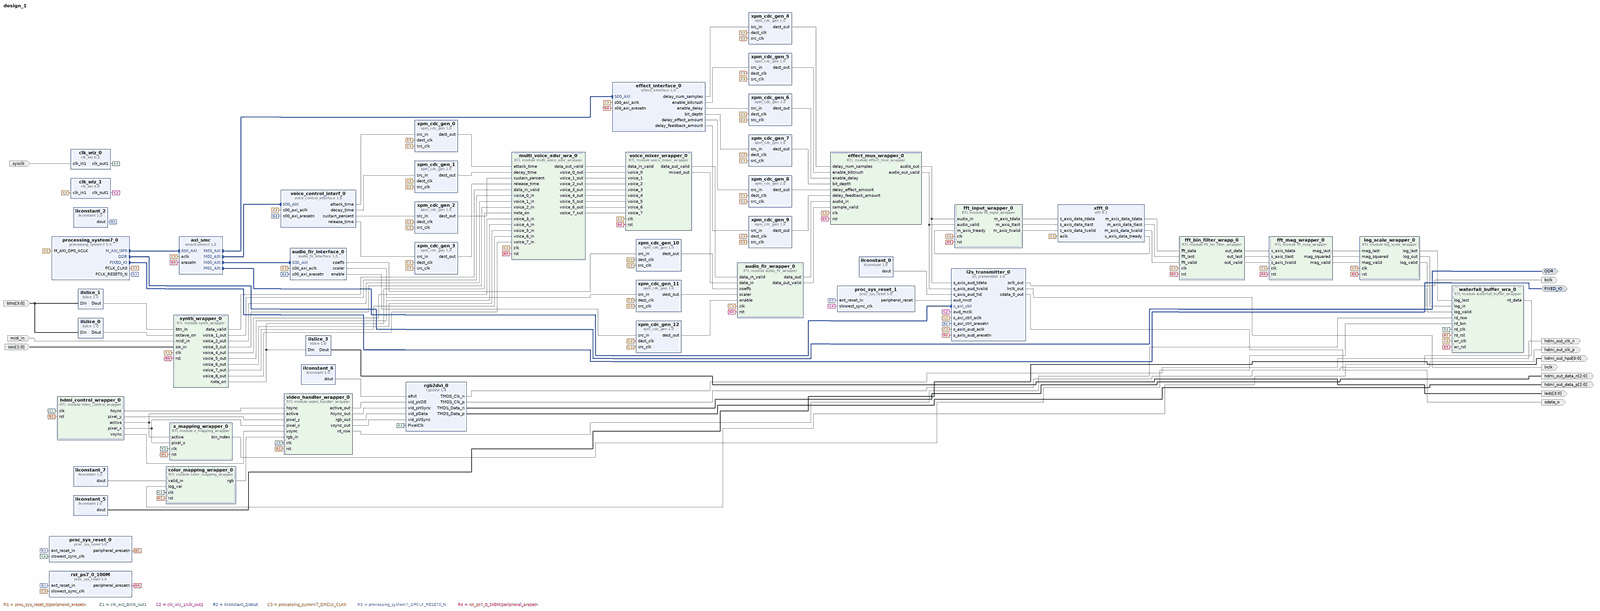
[diagram p0: block diagram of the top level, whole]
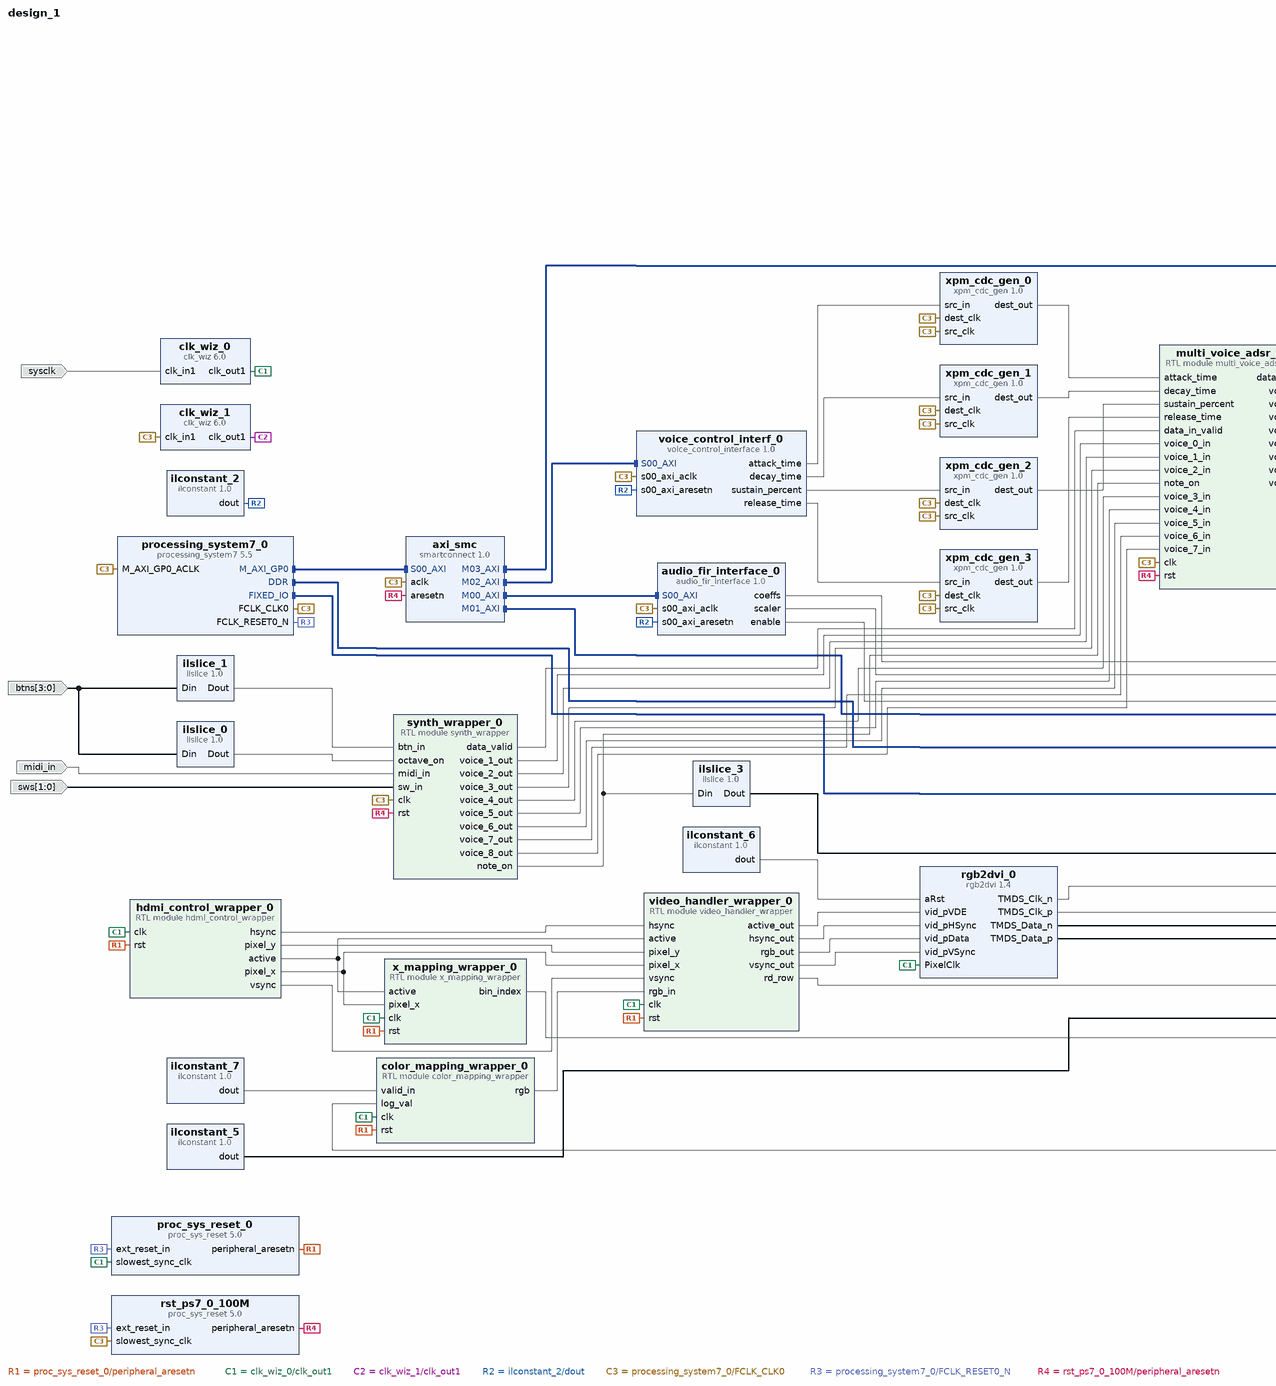
[diagram p1: block diagram of the top level, left part]
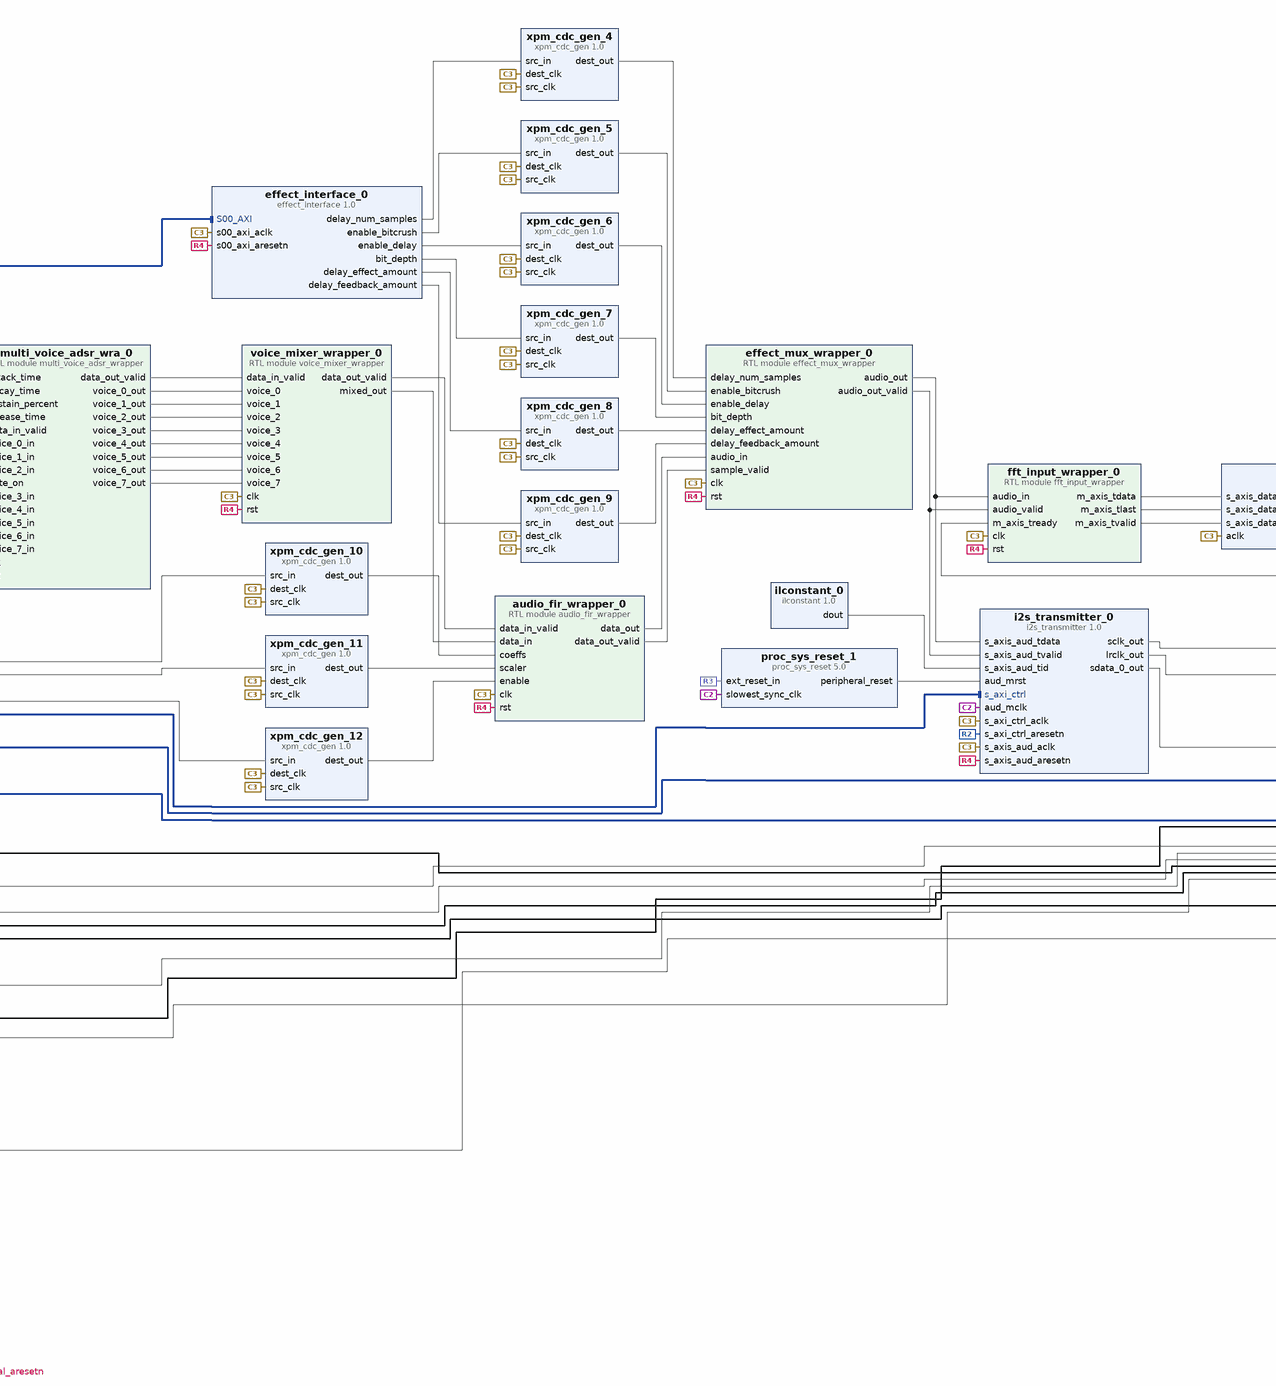
[diagram p2: block diagram of the top level, centre part]
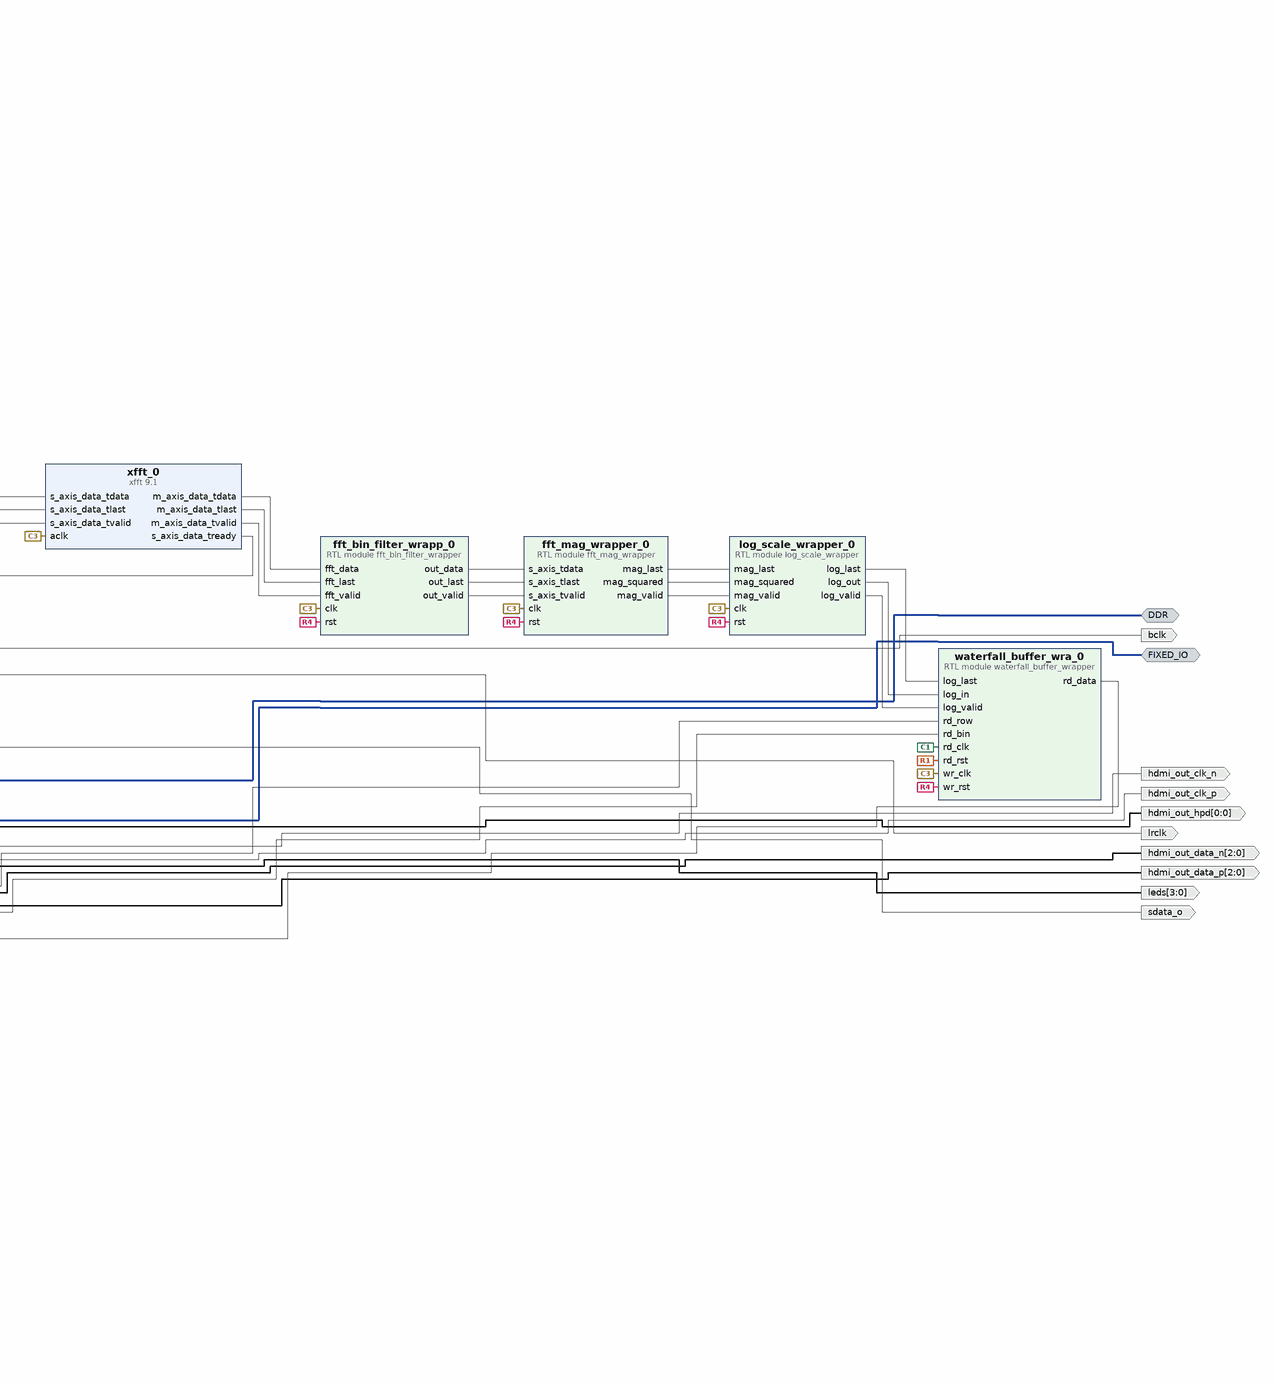
[diagram p3: block diagram of the top level, right part]
# Vivado block design design_1, xc7z020clg400-1, Vivado 2025.1
create_bd_design design_1

create_bd_intf_port -mode Master -vlnv xilinx.com:interface:ddrx_rtl:1.0 DDR
create_bd_intf_port -mode Master -vlnv xilinx.com:display_processing_system7:fixedio_rtl:1.0 FIXED_IO
create_bd_port -dir I -from 3 -to 0 btns
create_bd_port -dir I midi_in
create_bd_port -dir O lrclk
create_bd_port -dir O sdata_o
create_bd_port -dir O -from 3 -to 0 leds
create_bd_port -dir O hdmi_out_clk_p
create_bd_port -dir O hdmi_out_clk_n
create_bd_port -dir O -from 2 -to 0 hdmi_out_data_p
create_bd_port -dir O -from 2 -to 0 hdmi_out_data_n
create_bd_port -dir I sysclk
create_bd_port -dir O bclk
create_bd_port -dir O -from 0 -to 0 hdmi_out_hpd
create_bd_port -dir I -from 1 -to 0 sws

create_bd_cell -type ip -vlnv xilinx.com:ip:processing_system7:5.5 processing_system7_0
set_property -dict [list \
  CONFIG.PCW_APU_PERIPHERAL_FREQMHZ 650 \
  CONFIG.PCW_CRYSTAL_PERIPHERAL_FREQMHZ 50 \
  CONFIG.PCW_ENET0_ENET0_IO {MIO 16 .. 27} \
  CONFIG.PCW_ENET0_GRP_MDIO_ENABLE 1 \
  CONFIG.PCW_ENET0_GRP_MDIO_IO {MIO 52 .. 53} \
  CONFIG.PCW_ENET0_PERIPHERAL_ENABLE 1 \
  CONFIG.PCW_ENET0_RESET_ENABLE 1 \
  CONFIG.PCW_ENET0_RESET_IO {MIO 9} \
  CONFIG.PCW_ENET_RESET_ENABLE 1 \
  CONFIG.PCW_ENET_RESET_SELECT {Share reset pin} \
  CONFIG.PCW_FPGA0_PERIPHERAL_FREQMHZ 100 \
  CONFIG.PCW_FPGA1_PERIPHERAL_FREQMHZ 50 \
  CONFIG.PCW_GPIO_MIO_GPIO_ENABLE 1 \
  CONFIG.PCW_GPIO_MIO_GPIO_IO MIO \
  CONFIG.PCW_I2C_RESET_ENABLE 0 \
  CONFIG.PCW_M_AXI_GP0_FREQMHZ 10 \
  CONFIG.PCW_PERIPHERAL_BOARD_PRESET part0 \
  CONFIG.PCW_PRESET_BANK1_VOLTAGE {LVCMOS 1.8V} \
  CONFIG.PCW_QSPI_GRP_FBCLK_ENABLE 1 \
  CONFIG.PCW_QSPI_GRP_FBCLK_IO {MIO 8} \
  CONFIG.PCW_QSPI_GRP_SINGLE_SS_ENABLE 1 \
  CONFIG.PCW_QSPI_GRP_SINGLE_SS_IO {MIO 1 .. 6} \
  CONFIG.PCW_QSPI_PERIPHERAL_ENABLE 1 \
  CONFIG.PCW_QSPI_QSPI_IO {MIO 1 .. 6} \
  CONFIG.PCW_SD0_GRP_CD_ENABLE 1 \
  CONFIG.PCW_SD0_GRP_CD_IO {MIO 47} \
  CONFIG.PCW_SD0_GRP_WP_ENABLE 0 \
  CONFIG.PCW_SD0_PERIPHERAL_ENABLE 1 \
  CONFIG.PCW_SD0_SD0_IO {MIO 40 .. 45} \
  CONFIG.PCW_SDIO_PERIPHERAL_FREQMHZ 50 \
  CONFIG.PCW_SINGLE_QSPI_DATA_MODE x4 \
  CONFIG.PCW_UART0_PERIPHERAL_ENABLE 1 \
  CONFIG.PCW_UART0_UART0_IO {MIO 14 .. 15} \
  CONFIG.PCW_UART1_PERIPHERAL_ENABLE 0 \
  CONFIG.PCW_UART_PERIPHERAL_FREQMHZ 100 \
  CONFIG.PCW_UIPARAM_DDR_BUS_WIDTH {16 Bit} \
  CONFIG.PCW_UIPARAM_DDR_FREQ_MHZ 525 \
  CONFIG.PCW_UIPARAM_DDR_PARTNO {MT41J256M16 RE-125} \
  CONFIG.PCW_USB0_PERIPHERAL_ENABLE 1 \
  CONFIG.PCW_USB0_RESET_ENABLE 1 \
  CONFIG.PCW_USB0_RESET_IO {MIO 46} \
  CONFIG.PCW_USB0_USB0_IO {MIO 28 .. 39} \
  CONFIG.PCW_USB_RESET_ENABLE 1 \
  CONFIG.PCW_USB_RESET_SELECT {Share reset pin} \
  CONFIG.preset None \
] [get_bd_cells processing_system7_0]
# 497 more settings of processing_system7_0 are not shown: defaults, MIO pin electricals, DDR timing, and values the tool derives
create_bd_cell -type ip -vlnv xilinx.com:user:audio_fir_interface:1.0 audio_fir_interface_0
create_bd_cell -type ip -vlnv xilinx.com:ip:proc_sys_reset:5.0 rst_ps7_0_100M
create_bd_cell -type module -reference audio_fir_wrapper audio_fir_wrapper_0
set_property -dict {CONFIG.COEFF_WIDTH 16} [get_bd_cells audio_fir_wrapper_0]
create_bd_cell -type ip -vlnv xilinx.com:user:voice_control_interface:1.0 voice_control_interf_0
create_bd_cell -type module -reference voice_mixer_wrapper voice_mixer_wrapper_0
create_bd_cell -type module -reference multi_voice_adsr_wrapper multi_voice_adsr_wra_0
create_bd_cell -type inline_hdl -vlnv xilinx.com:inline_hdl:ilconstant:1.0 ilconstant_2
create_bd_cell -type module -reference effect_mux_wrapper effect_mux_wrapper_0
create_bd_cell -type module -reference synth_wrapper synth_wrapper_0
create_bd_cell -type inline_hdl -vlnv xilinx.com:inline_hdl:ilslice:1.0 ilslice_0
set_property -dict {CONFIG.DIN_WIDTH 4} [get_bd_cells ilslice_0]
create_bd_cell -type ip -vlnv xilinx.com:ip:i2s_transmitter:1.0 i2s_transmitter_0
set_property -dict {CONFIG.C_32BIT_LR 0} [get_bd_cells i2s_transmitter_0]
create_bd_cell -type inline_hdl -vlnv xilinx.com:inline_hdl:ilconstant:1.0 ilconstant_0
set_property -dict {CONFIG.CONST_VAL 0 CONFIG.CONST_WIDTH 3} [get_bd_cells ilconstant_0]
create_bd_cell -type inline_hdl -vlnv xilinx.com:inline_hdl:ilslice:1.0 ilslice_3
set_property -dict {CONFIG.DIN_FROM 3 CONFIG.DIN_WIDTH 8} [get_bd_cells ilslice_3]
create_bd_cell -type ip -vlnv xilinx.com:ip:xfft:9.1 xfft_0
set_property -dict [list \
  CONFIG.implementation_options pipelined_streaming_io \
  CONFIG.input_width 16 \
  CONFIG.number_of_stages_using_block_ram_for_data_and_phase_factors 3 \
  CONFIG.output_ordering natural_order \
  CONFIG.phase_factor_width 16 \
  CONFIG.rounding_modes truncation \
  CONFIG.scaling_options scaled \
  CONFIG.target_clock_frequency 100 \
] [get_bd_cells xfft_0]
create_bd_cell -type ip -vlnv digilentinc.com:ip:rgb2dvi:1.4 rgb2dvi_0
set_property -dict {CONFIG.kClkRange 3} [get_bd_cells rgb2dvi_0]
create_bd_cell -type inline_hdl -vlnv xilinx.com:inline_hdl:ilconstant:1.0 ilconstant_5
set_property -dict {CONFIG.CONST_VAL 1 CONFIG.CONST_WIDTH 1} [get_bd_cells ilconstant_5]
create_bd_cell -type inline_hdl -vlnv xilinx.com:inline_hdl:ilconstant:1.0 ilconstant_6
set_property -dict {CONFIG.CONST_VAL 0 CONFIG.CONST_WIDTH 1} [get_bd_cells ilconstant_6]
create_bd_cell -type module -reference fft_input_wrapper fft_input_wrapper_0
create_bd_cell -type ip -vlnv xilinx.com:ip:clk_wiz:6.0 clk_wiz_0
set_property -dict [list \
  CONFIG.CLKIN1_JITTER_PS 80.0 \
  CONFIG.CLKIN2_JITTER_PS 89.99 \
  CONFIG.CLKOUT1_DRIVES BUFG \
  CONFIG.CLKOUT1_JITTER 150.675 \
  CONFIG.CLKOUT1_PHASE_ERROR 96.948 \
  CONFIG.CLKOUT1_REQUESTED_OUT_FREQ 40 \
  CONFIG.CLKOUT2_DRIVES BUFG \
  CONFIG.CLKOUT3_DRIVES BUFG \
  CONFIG.CLKOUT4_DRIVES BUFG \
  CONFIG.CLKOUT5_DRIVES BUFG \
  CONFIG.CLKOUT6_DRIVES BUFG \
  CONFIG.CLKOUT7_DRIVES BUFG \
  CONFIG.CLK_IN1_BOARD_INTERFACE sys_clock \
  CONFIG.MMCM_BANDWIDTH OPTIMIZED \
  CONFIG.MMCM_CLKFBOUT_MULT_F 8 \
  CONFIG.MMCM_CLKIN1_PERIOD 8.000 \
  CONFIG.MMCM_CLKIN2_PERIOD 10.0 \
  CONFIG.MMCM_CLKOUT0_DIVIDE_F 25 \
  CONFIG.MMCM_COMPENSATION ZHOLD \
  CONFIG.MMCM_DIVCLK_DIVIDE 1 \
  CONFIG.PRIMITIVE PLL \
  CONFIG.RESET_PORT reset \
  CONFIG.RESET_TYPE ACTIVE_HIGH \
  CONFIG.SECONDARY_SOURCE Single_ended_clock_capable_pin \
  CONFIG.USE_INCLK_SWITCHOVER false \
  CONFIG.USE_LOCKED false \
  CONFIG.USE_RESET false \
] [get_bd_cells clk_wiz_0]
create_bd_cell -type ip -vlnv xilinx.com:ip:clk_wiz:6.0 clk_wiz_1
set_property -dict [list \
  CONFIG.CLKOUT1_JITTER 305.592 \
  CONFIG.CLKOUT1_PHASE_ERROR 298.923 \
  CONFIG.CLKOUT1_REQUESTED_OUT_FREQ 24 \
  CONFIG.MMCM_CLKFBOUT_MULT_F 50.250 \
  CONFIG.MMCM_CLKOUT0_DIVIDE_F 41.875 \
  CONFIG.MMCM_DIVCLK_DIVIDE 5 \
  CONFIG.USE_LOCKED false \
  CONFIG.USE_RESET false \
] [get_bd_cells clk_wiz_1]
create_bd_cell -type module -reference fft_bin_filter_wrapper fft_bin_filter_wrapp_0
create_bd_cell -type module -reference fft_mag_wrapper fft_mag_wrapper_0
create_bd_cell -type module -reference log_scale_wrapper log_scale_wrapper_0
create_bd_cell -type module -reference waterfall_buffer_wrapper waterfall_buffer_wra_0
create_bd_cell -type ip -vlnv xilinx.com:ip:smartconnect:1.0 axi_smc
set_property -dict {CONFIG.NUM_MI 4 CONFIG.NUM_SI 1} [get_bd_cells axi_smc]
create_bd_cell -type module -reference video_handler_wrapper video_handler_wrapper_0
create_bd_cell -type module -reference hdmi_control_wrapper hdmi_control_wrapper_0
create_bd_cell -type module -reference color_mapping_wrapper color_mapping_wrapper_0
create_bd_cell -type module -reference x_mapping_wrapper x_mapping_wrapper_0
create_bd_cell -type ip -vlnv xilinx.com:ip:proc_sys_reset:5.0 proc_sys_reset_0
create_bd_cell -type ip -vlnv xilinx.com:ip:proc_sys_reset:5.0 proc_sys_reset_1
create_bd_cell -type inline_hdl -vlnv xilinx.com:inline_hdl:ilconstant:1.0 ilconstant_7
set_property -dict {CONFIG.CONST_VAL 1 CONFIG.CONST_WIDTH 1} [get_bd_cells ilconstant_7]
create_bd_cell -type ip -vlnv xilinx.com:ip:xpm_cdc_gen:1.0 xpm_cdc_gen_0
set_property -dict {CONFIG.WIDTH 16} [get_bd_cells xpm_cdc_gen_0]
create_bd_cell -type ip -vlnv xilinx.com:ip:xpm_cdc_gen:1.0 xpm_cdc_gen_1
set_property -dict {CONFIG.WIDTH 16} [get_bd_cells xpm_cdc_gen_1]
create_bd_cell -type ip -vlnv xilinx.com:ip:xpm_cdc_gen:1.0 xpm_cdc_gen_2
set_property -dict {CONFIG.WIDTH 7} [get_bd_cells xpm_cdc_gen_2]
create_bd_cell -type ip -vlnv xilinx.com:ip:xpm_cdc_gen:1.0 xpm_cdc_gen_3
set_property -dict {CONFIG.WIDTH 16} [get_bd_cells xpm_cdc_gen_3]
create_bd_cell -type ip -vlnv xilinx.com:ip:xpm_cdc_gen:1.0 xpm_cdc_gen_4
set_property -dict {CONFIG.WIDTH 16} [get_bd_cells xpm_cdc_gen_4]
create_bd_cell -type ip -vlnv xilinx.com:ip:xpm_cdc_gen:1.0 xpm_cdc_gen_5
set_property -dict {CONFIG.WIDTH 1} [get_bd_cells xpm_cdc_gen_5]
create_bd_cell -type ip -vlnv xilinx.com:ip:xpm_cdc_gen:1.0 xpm_cdc_gen_6
set_property -dict {CONFIG.WIDTH 1} [get_bd_cells xpm_cdc_gen_6]
create_bd_cell -type ip -vlnv xilinx.com:ip:xpm_cdc_gen:1.0 xpm_cdc_gen_7
set_property -dict {CONFIG.WIDTH 5} [get_bd_cells xpm_cdc_gen_7]
create_bd_cell -type ip -vlnv xilinx.com:user:effect_interface:1.0 effect_interface_0
create_bd_cell -type ip -vlnv xilinx.com:ip:xpm_cdc_gen:1.0 xpm_cdc_gen_8
set_property -dict {CONFIG.WIDTH 8} [get_bd_cells xpm_cdc_gen_8]
create_bd_cell -type ip -vlnv xilinx.com:ip:xpm_cdc_gen:1.0 xpm_cdc_gen_9
set_property -dict {CONFIG.WIDTH 8} [get_bd_cells xpm_cdc_gen_9]
create_bd_cell -type ip -vlnv xilinx.com:ip:xpm_cdc_gen:1.0 xpm_cdc_gen_10
set_property -dict {CONFIG.WIDTH 1024} [get_bd_cells xpm_cdc_gen_10]
create_bd_cell -type ip -vlnv xilinx.com:ip:xpm_cdc_gen:1.0 xpm_cdc_gen_11
set_property -dict {CONFIG.WIDTH 16} [get_bd_cells xpm_cdc_gen_11]
create_bd_cell -type ip -vlnv xilinx.com:ip:xpm_cdc_gen:1.0 xpm_cdc_gen_12
set_property -dict {CONFIG.WIDTH 1} [get_bd_cells xpm_cdc_gen_12]
create_bd_cell -type inline_hdl -vlnv xilinx.com:inline_hdl:ilslice:1.0 ilslice_1
set_property -dict {CONFIG.DIN_FROM 3 CONFIG.DIN_TO 1 CONFIG.DIN_WIDTH 4} [get_bd_cells ilslice_1]

# ---- connections ----

connect_bd_intf_net [get_bd_intf_pins axi_smc/M00_AXI] [get_bd_intf_pins audio_fir_interface_0/S00_AXI]
connect_bd_intf_net [get_bd_intf_pins axi_smc/M01_AXI] [get_bd_intf_pins i2s_transmitter_0/s_axi_ctrl]
connect_bd_intf_net [get_bd_intf_pins axi_smc/M02_AXI] [get_bd_intf_pins voice_control_interf_0/S00_AXI]
connect_bd_intf_net [get_bd_intf_pins axi_smc/M03_AXI] [get_bd_intf_pins effect_interface_0/S00_AXI]
connect_bd_intf_net [get_bd_intf_ports DDR] [get_bd_intf_pins processing_system7_0/DDR]
connect_bd_intf_net [get_bd_intf_ports FIXED_IO] [get_bd_intf_pins processing_system7_0/FIXED_IO]
connect_bd_intf_net [get_bd_intf_pins processing_system7_0/M_AXI_GP0] [get_bd_intf_pins axi_smc/S00_AXI]
connect_bd_net [get_bd_pins proc_sys_reset_0/peripheral_aresetn] \
  [get_bd_pins hdmi_control_wrapper_0/rst] [get_bd_pins video_handler_wrapper_0/rst] [get_bd_pins x_mapping_wrapper_0/rst] \
  [get_bd_pins color_mapping_wrapper_0/rst] [get_bd_pins waterfall_buffer_wra_0/rd_rst]
connect_bd_net [get_bd_pins audio_fir_interface_0/coeffs] [get_bd_pins xpm_cdc_gen_10/src_in]
connect_bd_net [get_bd_pins audio_fir_interface_0/enable] [get_bd_pins xpm_cdc_gen_12/src_in]
connect_bd_net [get_bd_pins audio_fir_interface_0/scaler] [get_bd_pins xpm_cdc_gen_11/src_in]
connect_bd_net [get_bd_pins audio_fir_wrapper_0/data_out] [get_bd_pins effect_mux_wrapper_0/audio_in]
connect_bd_net [get_bd_pins audio_fir_wrapper_0/data_out_valid] [get_bd_pins effect_mux_wrapper_0/sample_valid]
connect_bd_net [get_bd_ports btns] [get_bd_pins ilslice_0/Din] [get_bd_pins ilslice_1/Din]
connect_bd_net [get_bd_pins clk_wiz_0/clk_out1] \
  [get_bd_pins rgb2dvi_0/PixelClk] [get_bd_pins waterfall_buffer_wra_0/rd_clk] [get_bd_pins hdmi_control_wrapper_0/clk] \
  [get_bd_pins video_handler_wrapper_0/clk] [get_bd_pins x_mapping_wrapper_0/clk] [get_bd_pins color_mapping_wrapper_0/clk] \
  [get_bd_pins proc_sys_reset_0/slowest_sync_clk]
connect_bd_net [get_bd_pins clk_wiz_1/clk_out1] [get_bd_pins i2s_transmitter_0/aud_mclk] [get_bd_pins proc_sys_reset_1/slowest_sync_clk]
connect_bd_net [get_bd_pins color_mapping_wrapper_0/rgb] [get_bd_pins video_handler_wrapper_0/rgb_in]
connect_bd_net [get_bd_pins effect_interface_0/bit_depth] [get_bd_pins xpm_cdc_gen_7/src_in]
connect_bd_net [get_bd_pins effect_interface_0/delay_effect_amount] [get_bd_pins xpm_cdc_gen_8/src_in]
connect_bd_net [get_bd_pins effect_interface_0/delay_feedback_amount] [get_bd_pins xpm_cdc_gen_9/src_in]
connect_bd_net [get_bd_pins effect_interface_0/delay_num_samples] [get_bd_pins xpm_cdc_gen_4/src_in]
connect_bd_net [get_bd_pins effect_interface_0/enable_bitcrush] [get_bd_pins xpm_cdc_gen_5/src_in]
connect_bd_net [get_bd_pins effect_interface_0/enable_delay] [get_bd_pins xpm_cdc_gen_6/src_in]
connect_bd_net [get_bd_pins effect_mux_wrapper_0/audio_out] \
  [get_bd_pins fft_input_wrapper_0/audio_in] [get_bd_pins i2s_transmitter_0/s_axis_aud_tdata]
connect_bd_net [get_bd_pins effect_mux_wrapper_0/audio_out_valid] \
  [get_bd_pins fft_input_wrapper_0/audio_valid] [get_bd_pins i2s_transmitter_0/s_axis_aud_tvalid]
connect_bd_net [get_bd_pins fft_bin_filter_wrapp_0/out_data] [get_bd_pins fft_mag_wrapper_0/s_axis_tdata]
connect_bd_net [get_bd_pins fft_bin_filter_wrapp_0/out_last] [get_bd_pins fft_mag_wrapper_0/s_axis_tlast]
connect_bd_net [get_bd_pins fft_bin_filter_wrapp_0/out_valid] [get_bd_pins fft_mag_wrapper_0/s_axis_tvalid]
connect_bd_net [get_bd_pins fft_input_wrapper_0/m_axis_tdata] [get_bd_pins xfft_0/s_axis_data_tdata]
connect_bd_net [get_bd_pins fft_input_wrapper_0/m_axis_tlast] [get_bd_pins xfft_0/s_axis_data_tlast]
connect_bd_net [get_bd_pins fft_input_wrapper_0/m_axis_tvalid] [get_bd_pins xfft_0/s_axis_data_tvalid]
connect_bd_net [get_bd_pins fft_mag_wrapper_0/mag_last] [get_bd_pins log_scale_wrapper_0/mag_last]
connect_bd_net [get_bd_pins fft_mag_wrapper_0/mag_squared] [get_bd_pins log_scale_wrapper_0/mag_squared]
connect_bd_net [get_bd_pins fft_mag_wrapper_0/mag_valid] [get_bd_pins log_scale_wrapper_0/mag_valid]
connect_bd_net [get_bd_pins hdmi_control_wrapper_0/active] [get_bd_pins video_handler_wrapper_0/active] [get_bd_pins x_mapping_wrapper_0/active]
connect_bd_net [get_bd_pins hdmi_control_wrapper_0/hsync] [get_bd_pins video_handler_wrapper_0/hsync]
connect_bd_net [get_bd_pins hdmi_control_wrapper_0/pixel_x] [get_bd_pins video_handler_wrapper_0/pixel_x] [get_bd_pins x_mapping_wrapper_0/pixel_x]
connect_bd_net [get_bd_pins hdmi_control_wrapper_0/pixel_y] [get_bd_pins video_handler_wrapper_0/pixel_y]
connect_bd_net [get_bd_pins hdmi_control_wrapper_0/vsync] [get_bd_pins video_handler_wrapper_0/vsync]
connect_bd_net [get_bd_pins i2s_transmitter_0/lrclk_out] [get_bd_ports lrclk]
connect_bd_net [get_bd_pins i2s_transmitter_0/sclk_out] [get_bd_ports bclk]
connect_bd_net [get_bd_pins i2s_transmitter_0/sdata_0_out] [get_bd_ports sdata_o]
connect_bd_net [get_bd_pins ilconstant_0/dout] [get_bd_pins i2s_transmitter_0/s_axis_aud_tid]
connect_bd_net [get_bd_pins ilconstant_2/dout] \
  [get_bd_pins audio_fir_interface_0/s00_axi_aresetn] [get_bd_pins voice_control_interf_0/s00_axi_aresetn] \
  [get_bd_pins i2s_transmitter_0/s_axi_ctrl_aresetn]
connect_bd_net [get_bd_pins ilconstant_5/dout] [get_bd_ports hdmi_out_hpd]
connect_bd_net [get_bd_pins ilconstant_6/dout] [get_bd_pins rgb2dvi_0/aRst]
connect_bd_net [get_bd_pins ilconstant_7/dout] [get_bd_pins color_mapping_wrapper_0/valid_in]
connect_bd_net [get_bd_pins ilslice_0/Dout] [get_bd_pins synth_wrapper_0/octave_on]
connect_bd_net [get_bd_pins ilslice_1/Dout] [get_bd_pins synth_wrapper_0/btn_in]
connect_bd_net [get_bd_pins ilslice_3/Dout] [get_bd_ports leds]
connect_bd_net [get_bd_pins log_scale_wrapper_0/log_last] [get_bd_pins waterfall_buffer_wra_0/log_last]
connect_bd_net [get_bd_pins log_scale_wrapper_0/log_out] [get_bd_pins waterfall_buffer_wra_0/log_in]
connect_bd_net [get_bd_pins log_scale_wrapper_0/log_valid] [get_bd_pins waterfall_buffer_wra_0/log_valid]
connect_bd_net [get_bd_ports midi_in] [get_bd_pins synth_wrapper_0/midi_in]
connect_bd_net [get_bd_pins multi_voice_adsr_wra_0/data_out_valid] [get_bd_pins voice_mixer_wrapper_0/data_in_valid]
connect_bd_net [get_bd_pins multi_voice_adsr_wra_0/voice_0_out] [get_bd_pins voice_mixer_wrapper_0/voice_0]
connect_bd_net [get_bd_pins multi_voice_adsr_wra_0/voice_1_out] [get_bd_pins voice_mixer_wrapper_0/voice_1]
connect_bd_net [get_bd_pins multi_voice_adsr_wra_0/voice_2_out] [get_bd_pins voice_mixer_wrapper_0/voice_2]
connect_bd_net [get_bd_pins multi_voice_adsr_wra_0/voice_3_out] [get_bd_pins voice_mixer_wrapper_0/voice_3]
connect_bd_net [get_bd_pins multi_voice_adsr_wra_0/voice_4_out] [get_bd_pins voice_mixer_wrapper_0/voice_4]
connect_bd_net [get_bd_pins multi_voice_adsr_wra_0/voice_5_out] [get_bd_pins voice_mixer_wrapper_0/voice_5]
connect_bd_net [get_bd_pins multi_voice_adsr_wra_0/voice_6_out] [get_bd_pins voice_mixer_wrapper_0/voice_6]
connect_bd_net [get_bd_pins multi_voice_adsr_wra_0/voice_7_out] [get_bd_pins voice_mixer_wrapper_0/voice_7]
connect_bd_net [get_bd_pins proc_sys_reset_1/peripheral_reset] [get_bd_pins i2s_transmitter_0/aud_mrst]
connect_bd_net [get_bd_pins processing_system7_0/FCLK_CLK0] \
  [get_bd_pins processing_system7_0/M_AXI_GP0_ACLK] [get_bd_pins audio_fir_interface_0/s00_axi_aclk] \
  [get_bd_pins rst_ps7_0_100M/slowest_sync_clk] [get_bd_pins voice_control_interf_0/s00_axi_aclk] \
  [get_bd_pins i2s_transmitter_0/s_axi_ctrl_aclk] [get_bd_pins audio_fir_wrapper_0/clk] \
  [get_bd_pins voice_mixer_wrapper_0/clk] [get_bd_pins xfft_0/aclk] [get_bd_pins fft_input_wrapper_0/clk] \
  [get_bd_pins i2s_transmitter_0/s_axis_aud_aclk] [get_bd_pins clk_wiz_1/clk_in1] [get_bd_pins fft_mag_wrapper_0/clk] \
  [get_bd_pins fft_bin_filter_wrapp_0/clk] [get_bd_pins log_scale_wrapper_0/clk] [get_bd_pins axi_smc/aclk] \
  [get_bd_pins effect_mux_wrapper_0/clk] [get_bd_pins waterfall_buffer_wra_0/wr_clk] [get_bd_pins multi_voice_adsr_wra_0/clk] \
  [get_bd_pins xpm_cdc_gen_0/src_clk] [get_bd_pins xpm_cdc_gen_0/dest_clk] [get_bd_pins xpm_cdc_gen_1/src_clk] \
  [get_bd_pins xpm_cdc_gen_1/dest_clk] [get_bd_pins xpm_cdc_gen_2/src_clk] [get_bd_pins xpm_cdc_gen_2/dest_clk] \
  [get_bd_pins xpm_cdc_gen_3/src_clk] [get_bd_pins xpm_cdc_gen_3/dest_clk] [get_bd_pins xpm_cdc_gen_10/dest_clk] \
  [get_bd_pins xpm_cdc_gen_10/src_clk] [get_bd_pins xpm_cdc_gen_11/dest_clk] [get_bd_pins xpm_cdc_gen_11/src_clk] \
  [get_bd_pins xpm_cdc_gen_12/src_clk] [get_bd_pins xpm_cdc_gen_12/dest_clk] [get_bd_pins xpm_cdc_gen_7/src_clk] \
  [get_bd_pins xpm_cdc_gen_7/dest_clk] [get_bd_pins xpm_cdc_gen_6/dest_clk] [get_bd_pins xpm_cdc_gen_6/src_clk] \
  [get_bd_pins xpm_cdc_gen_5/dest_clk] [get_bd_pins xpm_cdc_gen_5/src_clk] [get_bd_pins xpm_cdc_gen_4/dest_clk] \
  [get_bd_pins xpm_cdc_gen_4/src_clk] [get_bd_pins xpm_cdc_gen_9/src_clk] [get_bd_pins xpm_cdc_gen_9/dest_clk] \
  [get_bd_pins xpm_cdc_gen_8/dest_clk] [get_bd_pins xpm_cdc_gen_8/src_clk] [get_bd_pins effect_interface_0/s00_axi_aclk] \
  [get_bd_pins synth_wrapper_0/clk]
connect_bd_net [get_bd_pins processing_system7_0/FCLK_RESET0_N] \
  [get_bd_pins rst_ps7_0_100M/ext_reset_in] [get_bd_pins proc_sys_reset_0/ext_reset_in] \
  [get_bd_pins proc_sys_reset_1/ext_reset_in]
connect_bd_net [get_bd_pins rgb2dvi_0/TMDS_Clk_n] [get_bd_ports hdmi_out_clk_n]
connect_bd_net [get_bd_pins rgb2dvi_0/TMDS_Clk_p] [get_bd_ports hdmi_out_clk_p]
connect_bd_net [get_bd_pins rgb2dvi_0/TMDS_Data_n] [get_bd_ports hdmi_out_data_n]
connect_bd_net [get_bd_pins rgb2dvi_0/TMDS_Data_p] [get_bd_ports hdmi_out_data_p]
connect_bd_net [get_bd_pins rst_ps7_0_100M/peripheral_aresetn] \
  [get_bd_pins audio_fir_wrapper_0/rst] [get_bd_pins voice_mixer_wrapper_0/rst] [get_bd_pins fft_input_wrapper_0/rst] \
  [get_bd_pins i2s_transmitter_0/s_axis_aud_aresetn] [get_bd_pins fft_mag_wrapper_0/rst] \
  [get_bd_pins fft_bin_filter_wrapp_0/rst] [get_bd_pins log_scale_wrapper_0/rst] [get_bd_pins axi_smc/aresetn] \
  [get_bd_pins effect_mux_wrapper_0/rst] [get_bd_pins waterfall_buffer_wra_0/wr_rst] [get_bd_pins multi_voice_adsr_wra_0/rst] \
  [get_bd_pins effect_interface_0/s00_axi_aresetn] [get_bd_pins synth_wrapper_0/rst]
connect_bd_net [get_bd_ports sws] [get_bd_pins synth_wrapper_0/sw_in]
connect_bd_net [get_bd_pins synth_wrapper_0/data_valid] [get_bd_pins multi_voice_adsr_wra_0/data_in_valid]
connect_bd_net [get_bd_pins synth_wrapper_0/note_on] [get_bd_pins ilslice_3/Din] [get_bd_pins multi_voice_adsr_wra_0/note_on]
connect_bd_net [get_bd_pins synth_wrapper_0/voice_1_out] [get_bd_pins multi_voice_adsr_wra_0/voice_0_in]
connect_bd_net [get_bd_pins synth_wrapper_0/voice_2_out] [get_bd_pins multi_voice_adsr_wra_0/voice_1_in]
connect_bd_net [get_bd_pins synth_wrapper_0/voice_3_out] [get_bd_pins multi_voice_adsr_wra_0/voice_2_in]
connect_bd_net [get_bd_pins synth_wrapper_0/voice_4_out] [get_bd_pins multi_voice_adsr_wra_0/voice_3_in]
connect_bd_net [get_bd_pins synth_wrapper_0/voice_5_out] [get_bd_pins multi_voice_adsr_wra_0/voice_4_in]
connect_bd_net [get_bd_pins synth_wrapper_0/voice_6_out] [get_bd_pins multi_voice_adsr_wra_0/voice_5_in]
connect_bd_net [get_bd_pins synth_wrapper_0/voice_7_out] [get_bd_pins multi_voice_adsr_wra_0/voice_6_in]
connect_bd_net [get_bd_pins synth_wrapper_0/voice_8_out] [get_bd_pins multi_voice_adsr_wra_0/voice_7_in]
connect_bd_net [get_bd_ports sysclk] [get_bd_pins clk_wiz_0/clk_in1]
connect_bd_net [get_bd_pins video_handler_wrapper_0/active_out] [get_bd_pins rgb2dvi_0/vid_pVDE]
connect_bd_net [get_bd_pins video_handler_wrapper_0/hsync_out] [get_bd_pins rgb2dvi_0/vid_pHSync]
connect_bd_net [get_bd_pins video_handler_wrapper_0/rd_row] [get_bd_pins waterfall_buffer_wra_0/rd_row]
connect_bd_net [get_bd_pins video_handler_wrapper_0/rgb_out] [get_bd_pins rgb2dvi_0/vid_pData]
connect_bd_net [get_bd_pins video_handler_wrapper_0/vsync_out] [get_bd_pins rgb2dvi_0/vid_pVSync]
connect_bd_net [get_bd_pins voice_control_interf_0/attack_time] [get_bd_pins xpm_cdc_gen_0/src_in]
connect_bd_net [get_bd_pins voice_control_interf_0/decay_time] [get_bd_pins xpm_cdc_gen_1/src_in]
connect_bd_net [get_bd_pins voice_control_interf_0/release_time] [get_bd_pins xpm_cdc_gen_3/src_in]
connect_bd_net [get_bd_pins voice_control_interf_0/sustain_percent] [get_bd_pins xpm_cdc_gen_2/src_in]
connect_bd_net [get_bd_pins voice_mixer_wrapper_0/data_out_valid] [get_bd_pins audio_fir_wrapper_0/data_in_valid]
connect_bd_net [get_bd_pins voice_mixer_wrapper_0/mixed_out] [get_bd_pins audio_fir_wrapper_0/data_in]
connect_bd_net [get_bd_pins waterfall_buffer_wra_0/rd_data] [get_bd_pins color_mapping_wrapper_0/log_val]
connect_bd_net [get_bd_pins x_mapping_wrapper_0/bin_index] [get_bd_pins waterfall_buffer_wra_0/rd_bin]
connect_bd_net [get_bd_pins xfft_0/m_axis_data_tdata] [get_bd_pins fft_bin_filter_wrapp_0/fft_data]
connect_bd_net [get_bd_pins xfft_0/m_axis_data_tlast] [get_bd_pins fft_bin_filter_wrapp_0/fft_last]
connect_bd_net [get_bd_pins xfft_0/m_axis_data_tvalid] [get_bd_pins fft_bin_filter_wrapp_0/fft_valid]
connect_bd_net [get_bd_pins xfft_0/s_axis_data_tready] [get_bd_pins fft_input_wrapper_0/m_axis_tready]
connect_bd_net [get_bd_pins xpm_cdc_gen_0/dest_out] [get_bd_pins multi_voice_adsr_wra_0/attack_time]
connect_bd_net [get_bd_pins xpm_cdc_gen_10/dest_out] [get_bd_pins audio_fir_wrapper_0/coeffs]
connect_bd_net [get_bd_pins xpm_cdc_gen_11/dest_out] [get_bd_pins audio_fir_wrapper_0/scaler]
connect_bd_net [get_bd_pins xpm_cdc_gen_12/dest_out] [get_bd_pins audio_fir_wrapper_0/enable]
connect_bd_net [get_bd_pins xpm_cdc_gen_1/dest_out] [get_bd_pins multi_voice_adsr_wra_0/decay_time]
connect_bd_net [get_bd_pins xpm_cdc_gen_2/dest_out] [get_bd_pins multi_voice_adsr_wra_0/sustain_percent]
connect_bd_net [get_bd_pins xpm_cdc_gen_3/dest_out] [get_bd_pins multi_voice_adsr_wra_0/release_time]
connect_bd_net [get_bd_pins xpm_cdc_gen_4/dest_out] [get_bd_pins effect_mux_wrapper_0/delay_num_samples]
connect_bd_net [get_bd_pins xpm_cdc_gen_5/dest_out] [get_bd_pins effect_mux_wrapper_0/enable_bitcrush]
connect_bd_net [get_bd_pins xpm_cdc_gen_6/dest_out] [get_bd_pins effect_mux_wrapper_0/enable_delay]
connect_bd_net [get_bd_pins xpm_cdc_gen_7/dest_out] [get_bd_pins effect_mux_wrapper_0/bit_depth]
connect_bd_net [get_bd_pins xpm_cdc_gen_8/dest_out] [get_bd_pins effect_mux_wrapper_0/delay_effect_amount]
connect_bd_net [get_bd_pins xpm_cdc_gen_9/dest_out] [get_bd_pins effect_mux_wrapper_0/delay_feedback_amount]

# ---- address map ----
assign_bd_address -offset 0x43C00000 -range 64K -target_address_space [get_bd_addr_spaces processing_system7_0/Data] [get_bd_addr_segs audio_fir_interface_0/S00_AXI/S00_AXI_reg]
assign_bd_address -offset 0x43C10000 -range 64K -target_address_space [get_bd_addr_spaces processing_system7_0/Data] [get_bd_addr_segs voice_control_interf_0/S00_AXI/S00_AXI_reg]
assign_bd_address -offset 0x43C20000 -range 64K -target_address_space [get_bd_addr_spaces processing_system7_0/Data] [get_bd_addr_segs i2s_transmitter_0/s_axi_ctrl/Reg]
assign_bd_address -offset 0x43C30000 -range 64K -target_address_space [get_bd_addr_spaces processing_system7_0/Data] [get_bd_addr_segs effect_interface_0/S00_AXI/S00_AXI_reg]

validate_bd_design
save_bd_design
